# Altium project TLE5012.PrjPcb
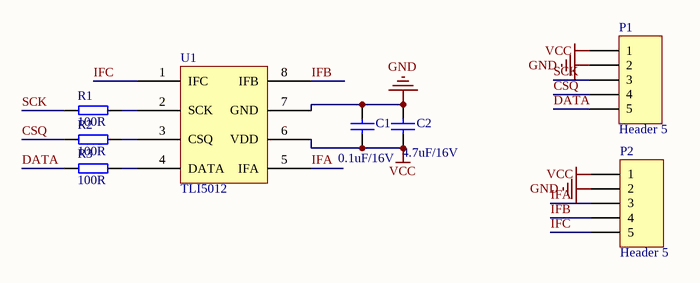
[diagram p0: TLE5012.SchDoc]
1 sheet, 8 parts. Net scope: global (net labels, ports and power ports of the same name join across sheets).
Board file: TLE5012.PcbDoc

## Sheet TLE5012.SchDoc
size A4

### Parts
C1  0.1uF/16V  [C0603]
C2  4.7uF/16V  [C0603]
P1  Header 5  [molex 53261-0571]
P2  Header 5  [molex 53261-0571]
R1  100R  [R0603]
R2  100R  [R0603]
R3  100R  [R0603]
U1  TLI5012  [SOIC-8]

### Nets
GND: C1.2 C2.2 P1.2 P2.2 U1.7(GND)
VCC: C1.1 C2.1 P1.1 P2.1 U1.6(VDD)
CSQ: P1.4 R2.1
DATA: P1.5 R3.1
IFA: P2.3 U1.5(IFA)
IFB: P2.4 U1.8(IFB)
IFC: P2.5 U1.1(IFC)
SCK: P1.3 R1.1
NetR1_2: R1.2 U1.2(SCK)
NetR2_2: R2.2 U1.3(CSQ)
NetR3_2: R3.2 U1.4(DATA)

### Library data of the parts
C1 C2 = cap
P1 P2 = Header 5: Header, 5-Pin; LatestRevisionDate: 17-Jul-2002; LatestRevisionNote: Re-released for DXP Platform.; Publisher: Altium Limited
R1-R3 = Resistance
U1 = TLE5012